# EAGLE schematic sample (EAGLE 7.5.0)
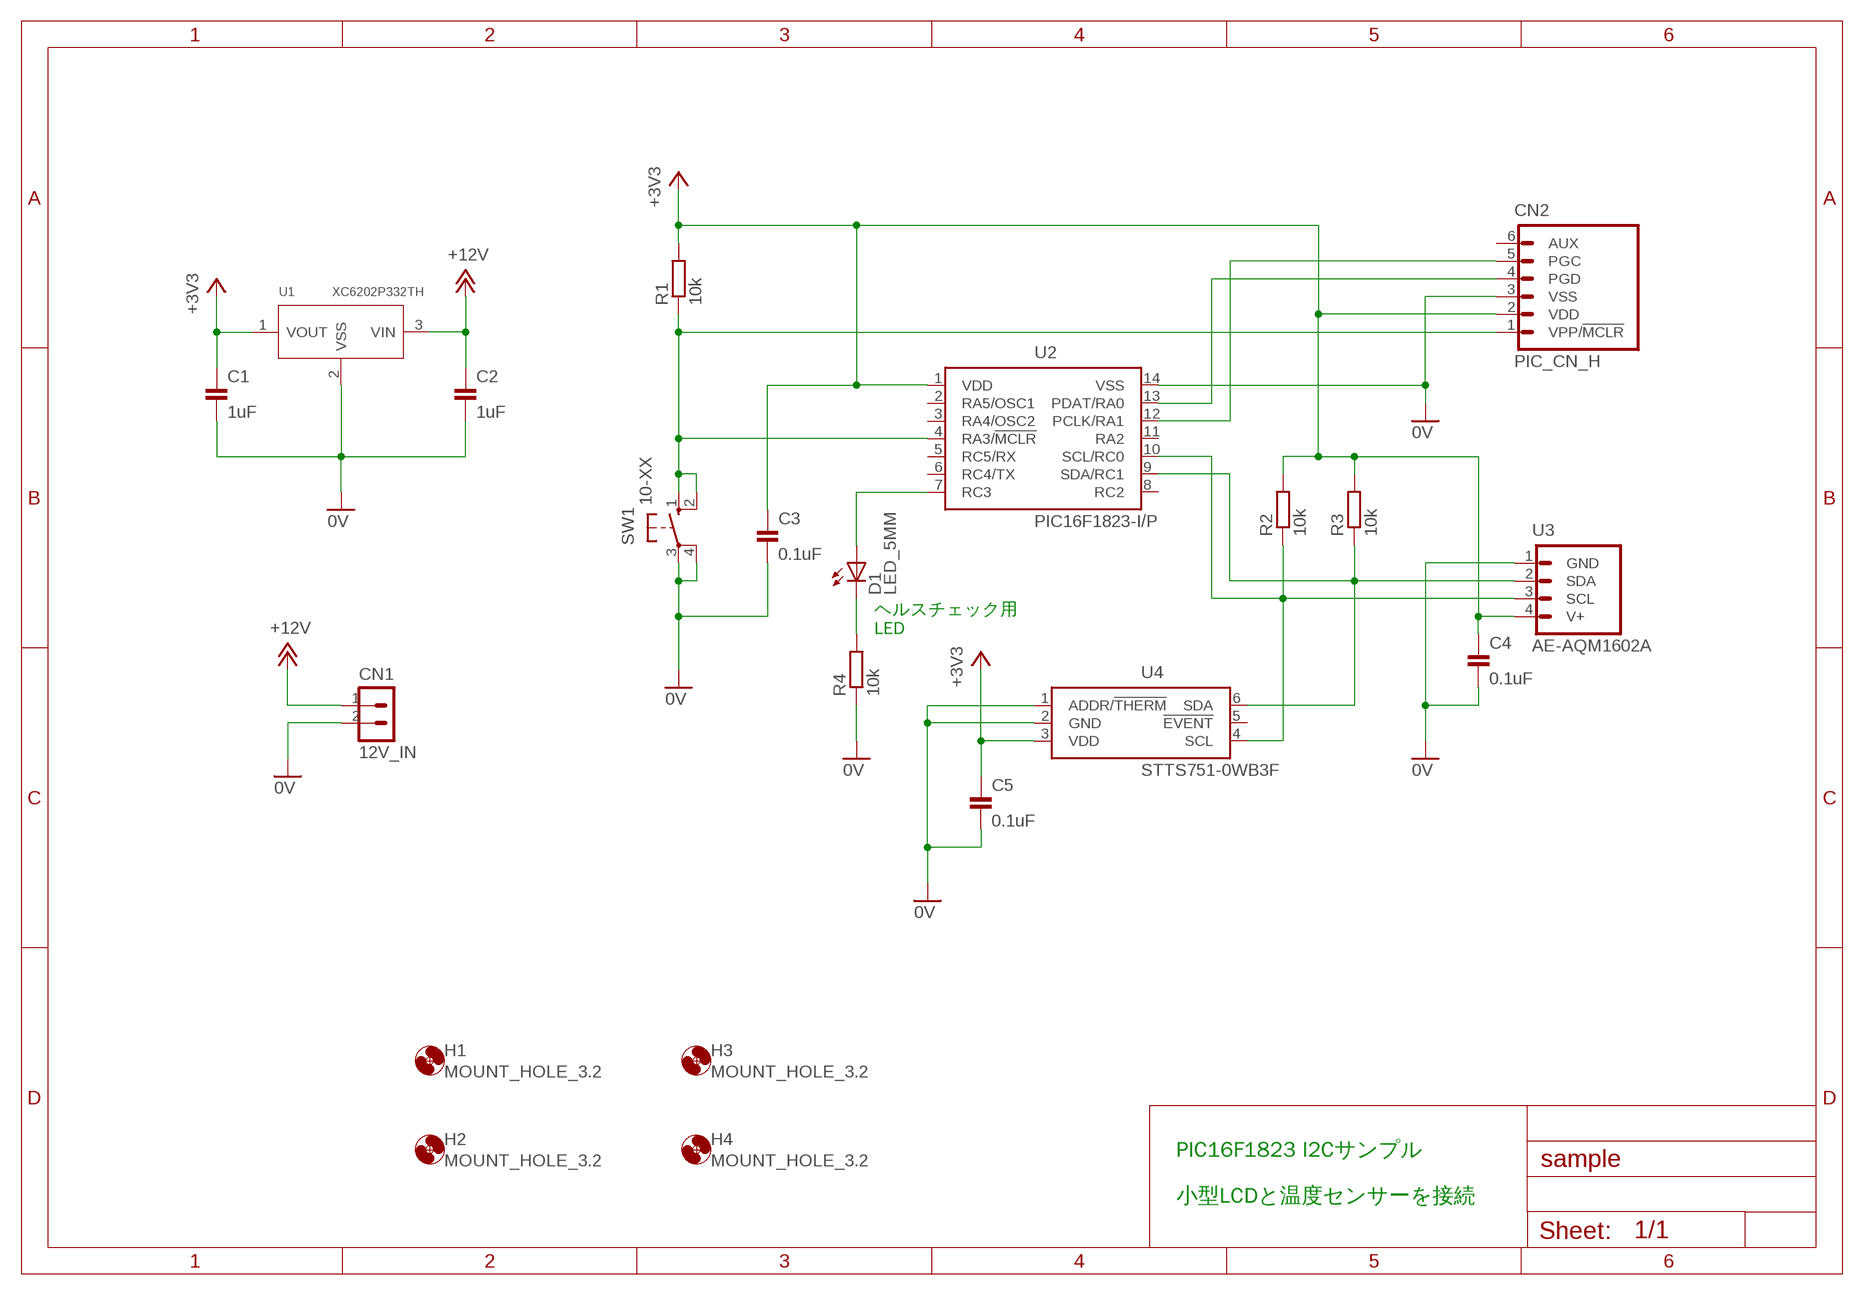
[diagram p0: schematic, sheet 1]

## Parts
C1  1uF  CAP_200MIL  [CAP_200MIL]
C2  1uF  CAP_200MIL  [CAP_200MIL]
C3  0.1uF  CAP_200MIL  [CAP_200MIL]
C4  0.1uF  CAP_200MIL  [CAP_200MIL]
C5  0.1uF  CAP_200MIL  [CAP_200MIL]
CN1  12V_IN  CONN_2PIN-L  [HEADER_L_2PIN]
CN2  PIC_CN_H  [HEADER_6PIN]
D1  LED_5MM  [LED5MM]
H1  MOUNT_HOLE_3.2  [3,2]
H2  MOUNT_HOLE_3.2  [3,2]
H3  MOUNT_HOLE_3.2  [3,2]
H4  MOUNT_HOLE_3.2  [3,2]
R1  10k  RESISTOR_300MIL  [RESISTOR_0207_300MIL]
R2  10k  RESISTOR_300MIL  [RESISTOR_0207_300MIL]
R3  10k  RESISTOR_300MIL  [RESISTOR_0207_300MIL]
R4  10k  RESISTOR_300MIL  [RESISTOR_0207_300MIL]
SW1  10-XX  [B3F-10XX]
U1  XC6202P332TH  [TO92-LINE]
U2  PIC16F1823-I/P  [DIL14]
U3  AE-AQM1602A  [AE-AQM1602A]
U4  STTS751-0WB3F  [SOT23-6L]

## Nets
0V: C1.2 C2.2 C3.2 C4.2 C5.2 CN1.2 CN2.3(VSS) R4.1 SW1.3(P) SW1.4(P1) U1.2(VSS) U2.14(VSS) U3.1(GND) U4.1(ADDR/!THERM!) U4.2(GND)
+3V3: C1.1 C3.1 C4.1 C5.1 CN2.2(VDD) R1.2 R2.2 R3.2 U1.1(VOUT) U2.1(VDD) U3.4(V+) U4.3(VDD)
+12V: C2.1 CN1.1 U1.3(VIN)
N$1: R3.1 U2.9(SDA/RC1) U3.2(SDA) U4.6(SDA)
N$2: CN2.4(PGD) U2.13(PDAT/RA0)
N$3: CN2.1(VPP/!MCLR) R1.1 SW1.1(S) SW1.2(S1) U2.4(RA3/!MCLR!)
N$4: CN2.5(PGC) U2.12(PCLK/RA1)
N$5: R2.1 U2.10(SCL/RC0) U3.3(SCL) U4.4(SCL)
N$6: D1.K(C) R4.2
N$7: D1.A U2.7(RC3)
Unconnected: CN2.6(AUX) U2.2(RA5/OSC1) U2.3(RA4/OSC2) U2.5(RC5/RX) U2.6(RC4/TX) U2.8(RC2) U2.11(RA2) U4.5(!EVENT!)

## Notes on the sheet
- ヘルスチェック用
  LED
- PIC16F1823 I2Cサンプル
  
  小型LCDと温度センサーを接続

## Library data of the parts
C1-C5 = Parts:CAP: コンデンサー
CN1 = Connectors:CONN_2PIN
CN2 = Connectors:PIC_CN: PICKit 3 インターフェースピン
D1 = Parts:LED: 発光ダイオード
H1-H4 = Generic:MOUNT_HOLE
R1-R4 = Parts:RESISTOR: 抵抗器
SW1 = Parts:10-XX: TACT SWITCH
U1 = Parts:XC6202*: 低損失ＣＭＯＳ三端子レギュレーター ・定格出力：５Ｖ ・最大出力電流：１５０ｍＡ以上 ・入力最大電圧：２０Ｖ ・入出力電圧差： ０．２Ｖ（３０ｍＡ時） ０．６７Ｖ（１００ｍＡ時） ・低消費電流：１０μＡ
U2 = Parts:PIC16F1823*: 14-Pin Flash Microcontrollers ・プログラムメモリ：２Ｋワード ・ＲＡＭ：１２８バイト ・ＥＥＰＲＯＭ：２５６バイト ・Ｉ／Ｏ：最大１２本 ・ＡＤコンバータ：１０ビットｘ８ｃｈ ・コンパレータ：２ｃｈ ・タイマー：８ビットｘ２，１６ビットｘ１ ・電源電圧：１．８Ｖ（１６ＭＨｚ ＭＡＸ）～５．５Ｖ（３２ＭＨｚ ＭＡＸ） ・動作クロック：３２ＭＨｚ ＭＡＸ
U3 = PartsForProto:AE-AQM1602A: LCDモジュール ピッチ変換キット Ｉ２Ｃ接続小型キャラクタＬＣＤモジュール AE-AQM1602A ◆６６ｍｍ×２７．７ｍｍ２．０ｍｍ （画面５４．７ｍｍｘ１０．８ｍｍ） ◆電源電圧は３．１～５．５Ｖ ◆低消費電流です：１ｍＡ＠３．３Ｖ
U4 = Parts:STTS751: 高精度１２ビットＩ２Ｃ接続デジタル温度センサ ・最大１２ビットの高分解能 ・温度測定精度 ±２℃ ・電源電圧：２．２５Ｖ～３．６Ｖ ・消費電流：５０μＡ ・インタフェース：Ｉ２Ｃ（２－Ｗｉｒｅ，ＳＭＢｕｓ） ・測定温度範囲：－４０℃～＋１２５℃ ・パッケージ：ＳＯＴ－２３－６